# Altium schematic sheet integrater.SchDoc
size A4; SheetNumber: 4; SheetTotal: 7
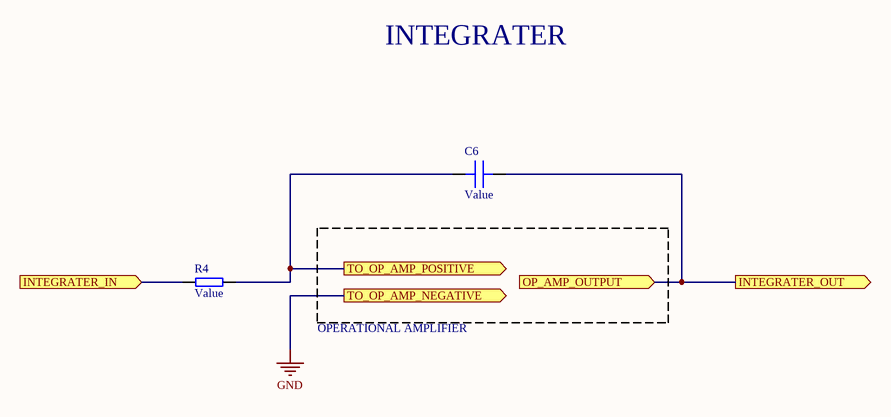
[diagram p0: integrater.SchDoc]

## Parts
C6  Value  [C 0402]
R4  Value  [R 0402]

## Ports
INTEGRATER_IN (in), INTEGRATER_OUT (out), OP_AMP_OUTPUT (in), TO_OP_AMP_NEGATIVE (out), TO_OP_AMP_POSITIVE (out)

## Nets
GND: port TO_OP_AMP_NEGATIVE
INTEGRATER_IN: R4.2 ; port INTEGRATER_IN
INTEGRATER_OUT: C6.2 ; port INTEGRATER_OUT, port OP_AMP_OUTPUT
TO_OP_AMP_POSITIVE: C6.1 R4.1 ; port TO_OP_AMP_POSITIVE

## Notes on the sheet
- INTEGRATER
- OPERATIONAL AMPLIFIER

## Library data of the parts
C6 = Capacitor: MLCC Capacitor
R4 = Resistor: General pourpouse resistor